# Altium project pm_project.PrjPcb
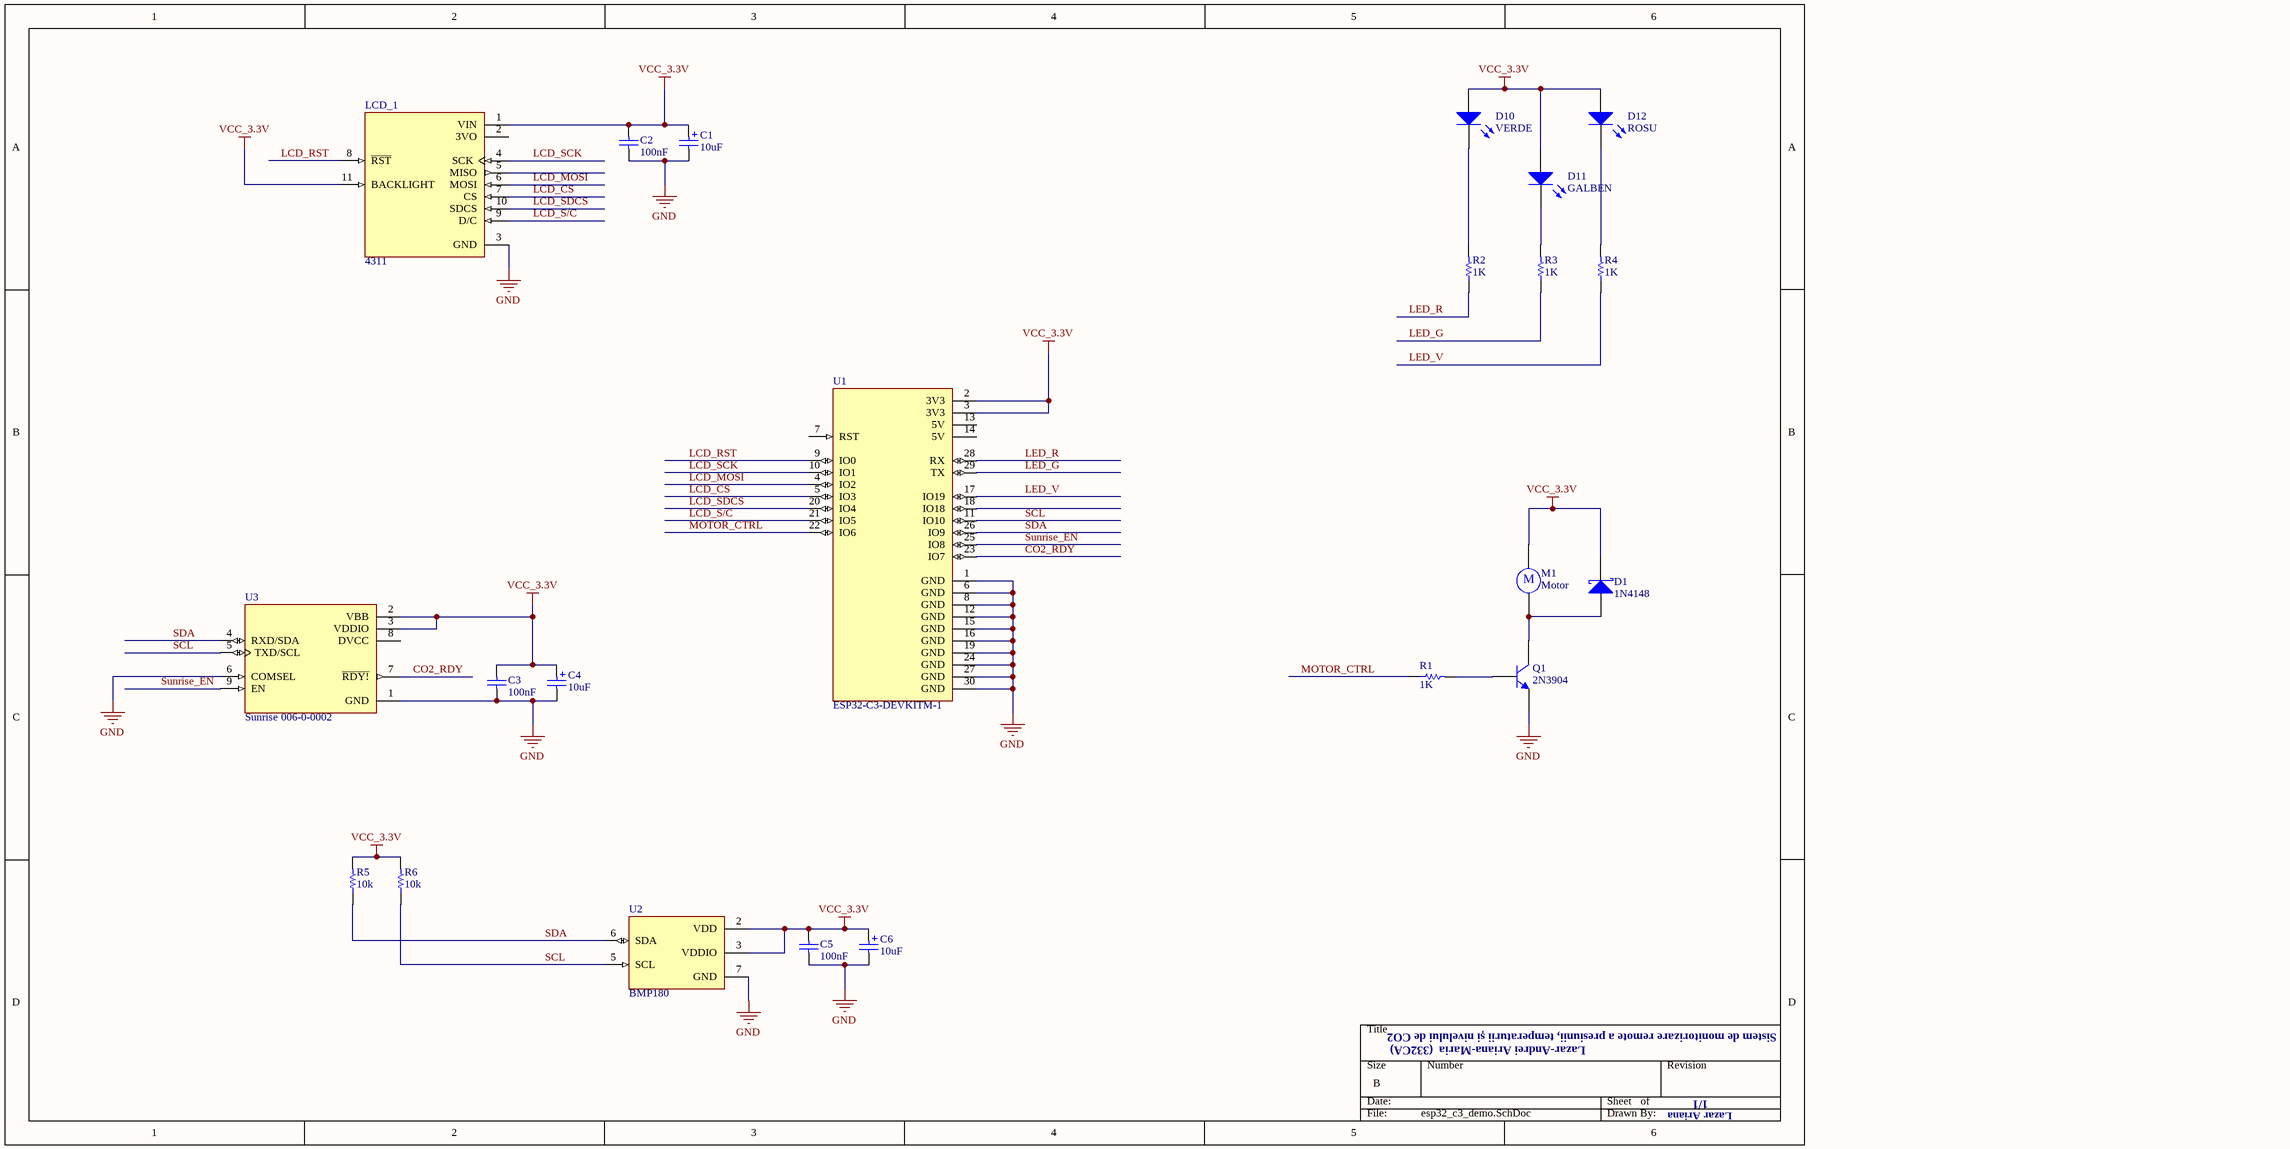
[diagram p0: esp32_c3_demo.SchDoc]
1 sheet, 22 parts. Net scope: global (net labels, ports and power ports of the same name join across sheets).

## Sheet esp32_c3_demo.SchDoc
size B

### Parts
C1  value 10uF  [POLAR0.8]  (hidden comment: Cap Pol2)
C2  value 100nF  [RAD-0.3]  (hidden comment: Cap)
C3  value 100nF  [RAD-0.3]  (hidden comment: Cap)
C4  value 10uF  [POLAR0.8]  (hidden comment: Cap Pol2)
C5  value 100nF  [RAD-0.3]  (hidden comment: Cap)
C6  value 10uF  [POLAR0.8]  (hidden comment: Cap Pol2)
D1  1N4148  [SMB]
D10  VERDE  [LED-0]
D11  GALBEN  [LED-0]
D12  ROSU  [LED-0]
LCD_1  4311  [MODULE_4311]
M1  Motor  [RB5-10.5]
Q1  2N3904  [TO-92A]
R1  value 1K  [AXIAL-0.3]  (hidden comment: Res1)
R2  value 1K  [AXIAL-0.3]  (hidden comment: Res1)
R3  value 1K  [AXIAL-0.3]  (hidden comment: Res1)
R4  value 1K  [AXIAL-0.3]  (hidden comment: Res1)
R5  value 10k  [AXIAL-0.3]  (hidden comment: Res1)
R6  value 10k  [AXIAL-0.3]  (hidden comment: Res1)
U1  ESP32-C3-DEVKITM-1  [XCVR_ESP32-C3-DEVKITM-1]
U2  BMP180  [BMP180]
U3  Sunrise 006-0-0002  [XDCR_006-0-0002]

### Nets
GND: C1.2 C2.1 C3.1 C4.2 C5.1 C6.2 LCD_1.3(GND) Q1.1(E) U1.1(GND) U1.6(GND) U1.8(GND) U1.12(GND) U1.15(GND) U1.16(GND) U1.19(GND) U1.24(GND) U1.27(GND) U1.30(GND) U2.7(GND) U3.1(GND) U3.6(COMSEL)
VCC_3.3V: C1.1 C2.2 C3.2 C4.1 C5.2 C6.1 D1.2(K) D10.1(A) D11.1(A) D12.1(A) LCD_1.1(VIN) LCD_1.11(BACKLIGHT) M1.1 R5.2 R6.2 U1.2(3V3) U1.3(3V3) U2.2(VDD) U2.3(VDDIO) U3.2(VBB) U3.3(VDDIO)
CO2_RDY: U1.23(IO7) U3.7(~{RDY!})
LCD_CS: LCD_1.7(CS) U1.5(IO3)
LCD_MOSI: LCD_1.6(MOSI) U1.4(IO2)
LCD_RST: LCD_1.8(~{RST}) U1.9(IO0)
LCD_S/C: LCD_1.9(D/C) U1.21(IO5)
LCD_SCK: LCD_1.4(SCK) U1.10(IO1)
LCD_SDCS: LCD_1.10(SDCS) U1.20(IO4)
LED_G: R3.1 U1.29(TX)
LED_R: R2.1 U1.28(RX)
LED_V: R4.1 U1.17(IO19)
MOTOR_CTRL: R1.1 U1.22(IO6)
SCL: R6.1 U1.11(IO10) U2.5(SCL) U3.5(TXD/SCL)
SDA: R5.1 U1.26(IO9) U2.6(SDA) U3.4(RXD/SDA)
Sunrise_EN: U1.25(IO8) U3.9(EN)
NetD1_1: D1.1(A) M1.2 Q1.3(C)
NetD10_2: D10.2(K) R2.2
NetD11_2: D11.2(K) R3.2
NetD12_2: D12.2(K) R4.2
NetQ1_2: Q1.2(B) R1.2

Not connected (* = marked no-connect by the designer): LCD_1 2(3VO) 5(MISO); U1 7(RST) 13(5V) 14(5V) 18(IO18); U3 8(DVCC)

### Notes on the sheet
- Lazar-Andrei Ariana-Maria  (332CA)
- Sistem de monitorizare remote a presiunii, temperaturii și nivelului de CO2
- 1/1
- Lazar Ariana
- (in symbol Motor) M

### Library data of the parts
C1 C4 C6 = Cap Pol2: Polarized Capacitor (Axial); Published: 8-Jun-2000; LatestRevisionDate: 17-Jul-2002; LatestRevisionNote: Re-released for DXP Platform.; PackageReference: POLAR0.8; Publisher: Altium Limited; PackageDescription: Polarized Capacitor; 2 Leads
C2 C3 C5 = Cap: Capacitor; Published: 8-Jun-2000; LatestRevisionDate: 17-Jul-2002; LatestRevisionNote: Re-released for DXP Platform.; PackageReference: RAD-0.3; Publisher: Altium Limited; PackageDescription: Radial Cap, Thru-Hole; 2 Leads; 0.3 in Pin Spacing
D1 = D Schottky: Schottky Diode; Published: 8-Jun-2000; LatestRevisionDate: 17-Jul-2002; LatestRevisionNote: Re-released for DXP Platform.; PackageReference: SMB; Publisher: Altium Limited; PackageDescription: DO-214-AA/SMB; 2 C-Bend Leads; Body 5.3 x 3.6 mm, inc. leads (LxW); Code_JEDEC: DO-214-AA
D10-D12 = LED0: Typical INFRARED GaAs LED; Published: 8-Jun-2000; LatestRevisionDate: 08-Jul-2005; LatestRevisionNote: Mech Layer 1 removed.; PackageReference: LED-0; Publisher: Altium Limited; PackageDescription: LED; 2 Leads
LCD_1 = 4311: Graphic LCD Display Module Red, Green, Blue (RGB) TFT - Color, IPS (In-Plane Switching) SPI 2 (50.80mm) 320 x 240; MF: Adafruit Industries LLC; SnapEDA_Link: https://www.snapeda.com/parts/4311/Adafruit+Industries/view-part/?ref=snap; Package: None; Value: *; MP: 4311; Check_prices: https://www.snapeda.com/parts/4311/Adafruit+Industries/view-part/?ref=eda
M1 = Motor: Motor, General Kind; Published: 24-Mar-1999; LatestRevisionDate: 17-Jul-2002; LatestRevisionNote: Re-released for DXP Platform.; PackageReference: RB5-10.5; Publisher: Altium Limited; PackageDescription: Capacitor (Radial); 2 Leads
Q1 = 2N3904: NPN General Purpose Amplifier; Published: 8-Jun-2000; LatestRevisionDate: 15-Jan-2003; LatestRevisionNote: PCB Footprint 'BCY-W3/D4.7' replaced; DatasheetVersion: 1997; PackageVersion: Sep-1998; PackageReference: TO-92A; Publisher: Altium Limited; PackageDescription: TO, Flat Index; 3 In-Line, Axial Leads; Body Dia. 4.5mm; Leads 0.51 x 0.48 mm (max); ComponentLink1Description: Manufacturer Link; ComponentLink1URL: http://www.fairchildsemi.com/; ComponentLink2Description: Datasheet; ComponentLink2URL: http://www.fairchildsemi.com/ds/2N%2F2N3904.pdf
R1-R6 = Res1: Resistor; Published: 8-Jun-2000; LatestRevisionDate: 17-Jul-2002; LatestRevisionNote: Re-released for DXP Platform.; PackageReference: AXIAL-0.3; Publisher: Altium Limited; PackageDescription: Axial Device, Thru-Hole; 2 Leads; 0.3 in Pin Spacing
U1 = ESP32-C3-DEVKITM-1: WiFi Development Tools (802.11) (ENGINEERING SAMPLE ONLY) ESP32-C3 General-Purpose Dev Board, Embeds ESP32-C3-MINI-1, 4 MB Flash, w/ Pin Header; MF: Espressif Systems; SnapEDA_Link: https://www.snapeda.com/parts/ESP32-C3-DEVKITM-1/Espressif+Systems/view-part/?ref=snap; Package: None; Value: *; MP: ESP32-C3-DEVKITM-1; Check_prices: https://www.snapeda.com/parts/ESP32-C3-DEVKITM-1/Espressif+Systems/view-part/?ref=eda
U2 = BMP180: Pressure Sensor 4.35PSI ~ 15.95PSI (30kPa ~ 110kPa) Absolute - 16 ~ 19 b 7-VLGA; MF: Bosch; SnapEDA_Link: https://www.snapeda.com/parts/BMP180/Bosch/view-part/?ref=snap; Package: LGA-7 Bosch; Value: *; MP: BMP180; Check_prices: https://www.snapeda.com/parts/BMP180/Bosch/view-part/?ref=eda
U3 = 006-0-0002: Carbon Dioxide (CO2) Sensor; MF: Senseair North America Inc.; Availability: Warning; Price: None; Package: None; DigiKey-Purchase-URL: https://snapeda.com/shop?store=DigiKey&id=4817567; Value: *; SnapEDA_Link: https://www.snapeda.com/parts/006-0-0002/Senseair%20North%20America%20Inc./view-part/4817567/?ref=snap; MP: 006-0-0002; Check_prices: https://www.snapeda.com/parts/006-0-0002/Senseair%20North%20America%20Inc./view-part/4817567/?ref=eda